# Altium project crw.PrjPCB
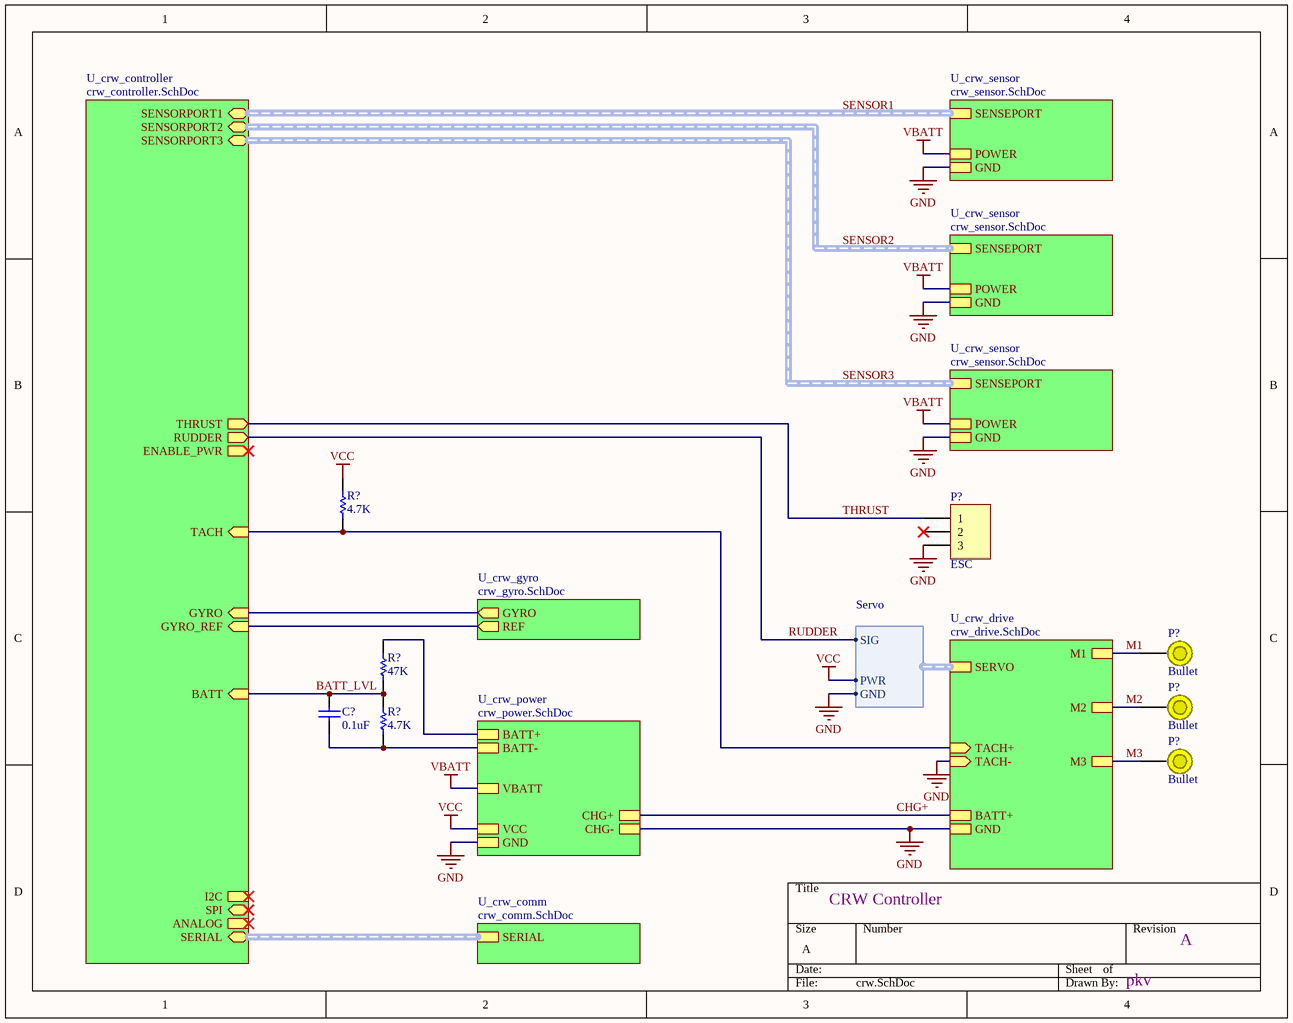
[diagram p0: crw.SchDoc]
7 sheets, 59 parts. Net scope: hierarchical (ports join the sheet entries above them; power ports are global).
Sheets:
  crw.SchDoc
    U_crw_controller = crw_controller.SchDoc
    U_crw_drive = crw_drive.SchDoc
    U_crw_sensor = crw_sensor.SchDoc
    U_crw_sensor = crw_sensor.SchDoc
    U_crw_sensor = crw_sensor.SchDoc
    U_crw_power = crw_power.SchDoc
    U_crw_gyro = crw_gyro.SchDoc
    U_crw_comm = crw_comm.SchDoc

## Sheet crw.SchDoc
size A

### Parts
(Parts that share a designator on the sheet are numbered #1, #2 ... from top to bottom, then left to right.)
C?#1  value 0.1uF  [0805]  (hidden comment: C0805)
P?#1  ESC  [HDR1X3H]
P?#2  Bullet
P?#3  Bullet
P?#4  Bullet
R?#1  value 4.7K  [2012[0805]]  (hidden comment: Res Semi)
R?#2  value 47K  [2012[0805]]  (hidden comment: Res Semi)
R?#3  value 4.7K  [2012[0805]]  (hidden comment: Res Semi)

### Sub-sheets
U_crw_comm = crw_comm.SchDoc: SERIAL (harness Serial)
U_crw_controller = crw_controller.SchDoc: RUDDER (out), THRUST (out), ANALOG (harness Analog), BATT (in), GYRO (in), I2C (harness I2C), ENABLE_PWR (out), SENSORPORT3 (harness SensorPort), SENSORPORT2 (harness SensorPort), SENSORPORT1 (harness SensorPort), SERIAL (harness Serial), TACH (in), GYRO_REF (in), SPI (harness SPI)
U_crw_drive = crw_drive.SchDoc: GND, M1, M2, M3, SERVO (harness Servo), BATT+, TACH+ (in), TACH- (in)
U_crw_gyro = crw_gyro.SchDoc: GYRO (out), REF (out)
U_crw_power = crw_power.SchDoc: BATT+, BATT-, VBATT, GND, CHG+, CHG-, VCC
U_crw_sensor = crw_sensor.SchDoc: SENSEPORT (harness SensorPort), POWER, GND
U_crw_sensor = crw_sensor.SchDoc: SENSEPORT (harness SensorPort), POWER, GND
U_crw_sensor = crw_sensor.SchDoc: SENSEPORT (harness SensorPort), POWER, GND

### Harnesses
Servo: GND, PWR, SIG

### Nets
GND: C?#1.2 P?#1.3 R?#3.2 ; sheet U_crw_drive/GND, sheet U_crw_drive/TACH-, sheet U_crw_sensor/GND, sheet U_crw_sensor/GND, sheet U_crw_sensor/GND, sheet U_crw_power/BATT-, sheet U_crw_power/GND, sheet U_crw_power/CHG-, sheet U_crw_drive/SERVO.GND
VBATT: sheet U_crw_sensor/POWER, sheet U_crw_sensor/POWER, sheet U_crw_sensor/POWER, sheet U_crw_power/VBATT
VCC: R?#1.1 ; sheet U_crw_power/VCC, sheet U_crw_drive/SERVO.PWR
BATT+: R?#2.1 ; sheet U_crw_power/BATT+
BATT_LVL: C?#1.1 R?#2.2 R?#3.1 ; sheet U_crw_controller/BATT
CHG+: sheet U_crw_drive/BATT+, sheet U_crw_power/CHG+
GREF: sheet U_crw_controller/GYRO_REF, sheet U_crw_gyro/REF
GYRO: sheet U_crw_controller/GYRO, sheet U_crw_gyro/GYRO
M1: P?#2.1 ; sheet U_crw_drive/M1
M2: P?#3.1 ; sheet U_crw_drive/M2
M3: P?#4.1 ; sheet U_crw_drive/M3
RUDDER: sheet U_crw_controller/RUDDER, sheet U_crw_drive/SERVO.SIG
THRUST: P?#1.1 ; sheet U_crw_controller/THRUST
NetR?#1_2: R?#1.2 ; sheet U_crw_controller/TACH, sheet U_crw_drive/TACH+

Not connected (* = marked no-connect by the designer): P?#1 2*

### Buses and harness runs
harness SENSOR1 = sheet U_crw_controller/SENSORPORT1 = sheet U_crw_sensor/SENSEPORT
harness SENSOR2 = sheet U_crw_controller/SENSORPORT2 = sheet U_crw_sensor/SENSEPORT
harness SENSOR3 = sheet U_crw_controller/SENSORPORT3 = sheet U_crw_sensor/SENSEPORT
harness sheet U_crw_comm/SERIAL = sheet U_crw_controller/SERIAL

### Notes on the sheet
- CRW Controller
- A
- pkv

### Library data of the parts
C?#1 = C0805: Ceramic Chip Capacitor - Standard; Note: Footprint corresponds to dimensions for bulk cassette packaging. This case size has tightened tolerances.; Published: 17-Jul-2002; LatestRevisionDate: 19-Mar-2004; LatestRevisionNote: Silkscreen size reduced.; DatasheetDocument: Mar-2001; PackageDocument: Mar-2001; PackageReference: 0805; Publisher: Altium Limited; Code_JEITA: 0805; Code_IPC: 2012[0805]; ComponentLink1Description: Manufacturer Link; ComponentLink1URL: http://www.kemet.com/; ComponentLink2Description: Datasheet; ComponentLink2URL: http://www.kemet.com/kemet/web/homepage/kechome.nsf/vapubfilesname/F3102TA.pdf/$file/F3102TA.pdf
P?#1 = Header 3H: Header, 3-Pin, Right Angle; LatestRevisionDate: 17-Jul-2002; LatestRevisionNote: Re-released for DXP Platform.; Publisher: Altium Limited
P?#2-P?#4 = BulletConnector: 3.5mm Plated Bullet Style Connector
R?#1-R?#3 = Res Semi: Semiconductor Resistor; Published: 8-Jun-2000; LatestRevisionDate: 17-Jul-2002; LatestRevisionNote: Re-released for DXP Platform.; PackageReference: AXIAL-0.5; Publisher: Altium Limited

## Sheet crw_controller.SchDoc
size A
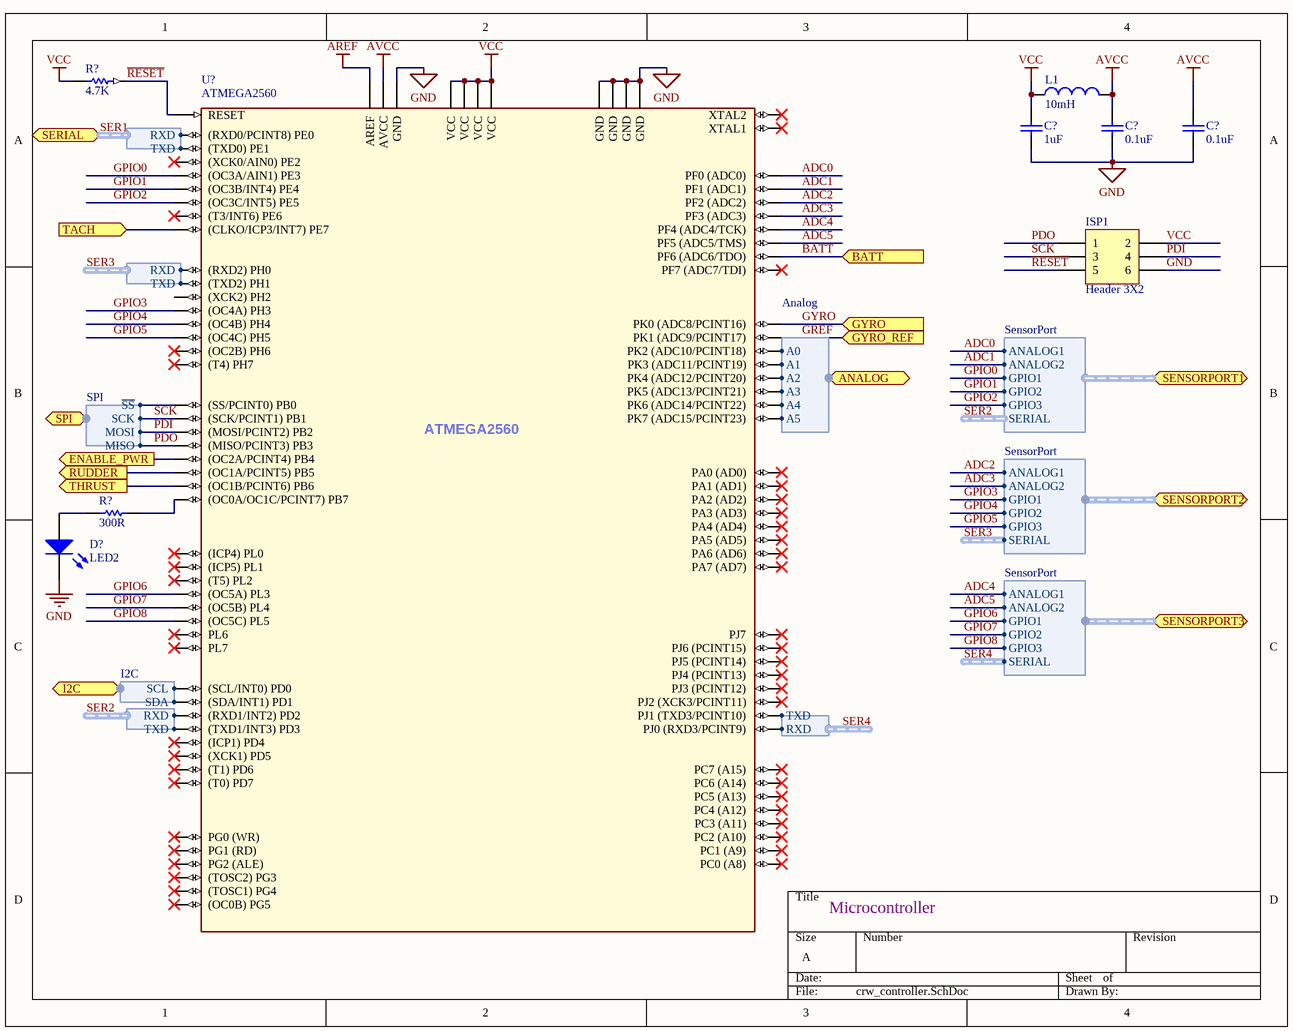
[diagram p1: crw_controller.SchDoc]

### Parts
(Parts that share a designator on the sheet are numbered #1, #2 ... from top to bottom, then left to right.)
C?#2  value 1uF  [0805]  (hidden comment: C0805)
C?#3  value 0.1uF  [0805]  (hidden comment: C0805)
C?#4  value 0.1uF  [0805]  (hidden comment: C0805)
D?#1  LED2  [3.2X1.6X1.1]
ISP1  Header 3X2  [HDR2X3]
L1  value 10mH  [3261]  (hidden comment: Inductor)
R?#4  value 4.7K  [2012[0805]]  (hidden comment: Res Semi)
R?#5  value 300R  [2012[0805]]  (hidden comment: Res Semi)
U?#1  ATMEGA2560  [MY_ATMEGA2560]

### Ports
ANALOG (harness Analog), BATT (in), ENABLE_PWR (out), GYRO (in), GYRO_REF (in), I2C (harness I2C), RUDDER (out), SENSORPORT1 (harness SensorPort), SENSORPORT2 (harness SensorPort), SENSORPORT3 (harness SensorPort), SERIAL (harness Serial), SPI (harness SPI), TACH (in), THRUST (out)

### Harnesses
Serial: RXD, TXD
SensorPort: ANALOG1, ANALOG2, GPIO1, GPIO2, GPIO3, SERIAL
Analog: A0, A1, A2, A3, A4, A5
SPI: ~{SS}, SCK, MISO, MOSI
I2C: SDA, SCL

### Nets
AREF: U?#1.98(AREF)
AVCC: C?#3.2 C?#4.2 L1.2 U?#1.100(AVCC)
GND: C?#2.1 C?#3.1 C?#4.1 D?#1.2(K) ISP1.6 U?#1.11(GND) U?#1.32(GND) U?#1.62(GND) U?#1.81(GND) U?#1.99(GND)
VCC: C?#2.2 ISP1.2 L1.1 R?#4.1 U?#1.10(VCC) U?#1.31(VCC) U?#1.61(VCC) U?#1.80(VCC)
ADC0: U?#1.97(PF0_(ADC0)) ; port SENSORPORT1.ANALOG1  [project net SENSOR1.ANALOG1]
ADC1: U?#1.96(PF1_(ADC1)) ; port SENSORPORT1.ANALOG2  [project net SENSOR1.ANALOG2]
ADC2: U?#1.95(PF2_(ADC2)) ; port SENSORPORT2.ANALOG1  [project net SENSOR2.ANALOG1]
ADC3: U?#1.94(PF3_(ADC3)) ; port SENSORPORT2.ANALOG2  [project net SENSOR2.ANALOG2]
ADC4: U?#1.93(PF4_(ADC4/TCK)) ; port SENSORPORT3.ANALOG1  [project net SENSOR3.ANALOG1]
ADC5: U?#1.92(PF5_(ADC5/TMS)) ; port SENSORPORT3.ANALOG2  [project net SENSOR3.ANALOG2]
BATT: U?#1.91(PF6_(ADC6/TDO)) ; port BATT  [project net BATT_LVL]
GPIO0: U?#1.5((OC3A/AIN1)_PE3) ; port SENSORPORT1.GPIO1  [project net SENSOR1.GPIO1]
GPIO1: U?#1.6((OC3B/INT4)_PE4) ; port SENSORPORT1.GPIO2  [project net SENSOR1.GPIO2]
GPIO2: U?#1.7((OC3C/INT5)_PE5) ; port SENSORPORT1.GPIO3  [project net SENSOR1.GPIO3]
GPIO3: U?#1.15((OC4A)_PH3) ; port SENSORPORT2.GPIO1  [project net SENSOR2.GPIO1]
GPIO4: U?#1.16((OC4B)_PH4) ; port SENSORPORT2.GPIO2  [project net SENSOR2.GPIO2]
GPIO5: U?#1.17((OC4C)_PH5) ; port SENSORPORT2.GPIO3  [project net SENSOR2.GPIO3]
GPIO6: U?#1.38((OC5A)_PL3) ; port SENSORPORT3.GPIO1  [project net SENSOR3.GPIO1]
GPIO7: U?#1.39((OC5B)_PL4) ; port SENSORPORT3.GPIO2  [project net SENSOR3.GPIO2]
GPIO8: U?#1.40((OC5C)_PL5) ; port SENSORPORT3.GPIO3  [project net SENSOR3.GPIO3]
GREF: U?#1.88(PK1_(ADC9/PCINT17)) ; port GYRO_REF
GYRO: U?#1.89(PK0_(ADC8/PCINT16)) ; port GYRO
PDI: ISP1.4 U?#1.21((MOSI/PCINT2)_PB2) ; port SPI.MOSI
PDO: ISP1.1 U?#1.22((MISO/PCINT3)_PB3) ; port SPI.MISO
~{RESET}: ISP1.5 R?#4.2 U?#1.30(RESET)
RUDDER: U?#1.24((OC1A/PCINT5)_PB5) ; port RUDDER
SCK: ISP1.3 U?#1.20((SCK/PCINT1)_PB1) ; port SPI.SCK
SER2.RXD: U?#1.45((RXD1/INT2)_PD2) ; harness Serial.RXD
SER2.TXD: U?#1.46((TXD1/INT3)_PD3) ; harness Serial.TXD
SER4.RXD: U?#1.63(PJ0_(RXD3/PCINT9)) ; harness Serial.RXD
SER4.TXD: U?#1.64(PJ1_(TXD3/PCINT10)) ; harness Serial.TXD
THRUST: U?#1.25((OC1B/PCINT6)_PB6) ; port THRUST
NetD?#1_1: D?#1.1(A) R?#5.1
NetR?#1_2: U?#1.9((CLKO/ICP3/INT7)_PE7) ; port TACH
NetR?#5_2: R?#5.2 U?#1.26((OC0A/OC1C/PCINT7)_PB7)
NetU?#1_19: U?#1.19((SS/PCINT0)_PB0) ; port SPI.~{SS}
NetU?#1_23: U?#1.23((OC2A/PCINT4)_PB4) ; port ENABLE_PWR
NetU?#1_43: U?#1.43((SCL/INT0)_PD0) ; port I2C.SCL
NetU?#1_44: U?#1.44((SDA/INT1)_PD1) ; port I2C.SDA
NetU?#1_82: U?#1.82(PK7_(ADC15/PCINT23)) ; port ANALOG.A5
NetU?#1_83: U?#1.83(PK6_(ADC14/PCINT22)) ; port ANALOG.A4
NetU?#1_84: U?#1.84(PK5_(ADC13/PCINT21)) ; port ANALOG.A3
NetU?#1_85: U?#1.85(PK4_(ADC12/PCINT20)) ; port ANALOG.A2
NetU?#1_86: U?#1.86(PK3_(ADC11/PCINT19)) ; port ANALOG.A1
NetU?#1_87: U?#1.87(PK2_(ADC10/PCINT18)) ; port ANALOG.A0

Not connected (* = marked no-connect by the designer): U?#1 1((OC0B)_PG5)* 2((RXD0/PCINT8)_PE0) 3((TXD0)_PE1) 4((XCK0/AIN0)_PE2)* 8((T3/INT6)_PE6)* 12((RXD2)_PH0) 13((TXD2)_PH1) 14((XCK2)_PH2) 18((OC2B)_PH6)* 27((T4)_PH7)* 28((TOSC2)_PG3)* 29((TOSC1)_PG4)* 33(XTAL2)* 34(XTAL1)* 35((ICP4)_PL0)* 36((ICP5)_PL1)* 37((T5)_PL2)* 41(PL6)* 42(PL7)* 47((ICP1)_PD4)* 48((XCK1)_PD5)* 49((T1)_PD6)* 50((T0)_PD7)* 51(PG0_(WR))* 52(PG1_(RD))* 53(PC0_(A8))* 54(PC1_(A9))* 55(PC2_(A10))* 56(PC3_(A11))* 57(PC4_(A12))* 58(PC5_(A13))* 59(PC6_(A14))* 60(PC7_(A15))* 65(PJ2_(XCK3/PCINT11))* 66(PJ3_(PCINT12))* 67(PJ4_(PCINT13))* 68(PJ5_(PCINT14))* 69(PJ6_(PCINT15))* 70(PG2_(ALE))* 71(PA7_(AD7))* 72(PA6_(AD6))* 73(PA5_(AD5))* 74(PA4_(AD4))* 75(PA3_(AD3))* 76(PA2_(AD2))* 77(PA1_(AD1))* 78(PA0_(AD0))* 79(PJ7)* 90(PF7_(ADC7/TDI))*

### Buses and harness runs
harness SER1 = port SERIAL

### Notes on the sheet
- Microcontroller

### Library data of the parts
C?#2-C?#4 = C0805: as C?#1 on sheet crw; Published: 17-Jul-2002; LatestRevisionDate: 19-Mar-2004; LatestRevisionNote: Silkscreen size reduced.; DatasheetDocument: Mar-2001; PackageDocument: Mar-2001; PackageReference: 0805; Publisher: Altium Limited; Code_JEITA: 0805; Code_IPC: 2012[0805]; ComponentLink1Description: Manufacturer Link; ComponentLink1URL: http://www.kemet.com/; ComponentLink2Description: Datasheet; ComponentLink2URL: http://www.kemet.com/kemet/web/homepage/kechome.nsf/vapubfilesname/F3102TA.pdf/$file/F3102TA.pdf
D?#1 = LED2: Typical RED, GREEN, YELLOW, AMBER GaAs LED; Published: 8-Jun-2000; LatestRevisionDate: 17-Jul-2002; LatestRevisionNote: Re-released for DXP Platform.; PackageDocument: Feb-2002; PackageReference: 3.2X1.6X1.1; Publisher: Altium Limited
ISP1 = Header 3X2: Header, 3-Pin, Dual row; LatestRevisionDate: 17-Jul-2002; LatestRevisionNote: Re-released for DXP Platform.; Publisher: Altium Limited
L1 = Inductor: Code_IEC: 1005; Published: 8-Jun-2000; LatestRevisionDate: 17-Jul-2002; LatestRevisionNote: Re-released for DXP Platform.; PackageReference: 0402-A; Publisher: Altium Limited; Code_JEITA: 0402
R?#4 R?#5 = Res Semi: Semiconductor Resistor; Published: 8-Jun-2000; LatestRevisionDate: 17-Jul-2002; LatestRevisionNote: Re-released for DXP Platform.; PackageReference: AXIAL-0.5; Publisher: Altium Limited
U?#1 = ATMEGA2560: AVR 256K Bytes of In-System Programmable Flash Memory

## Sheet crw_drive.SchDoc
size A
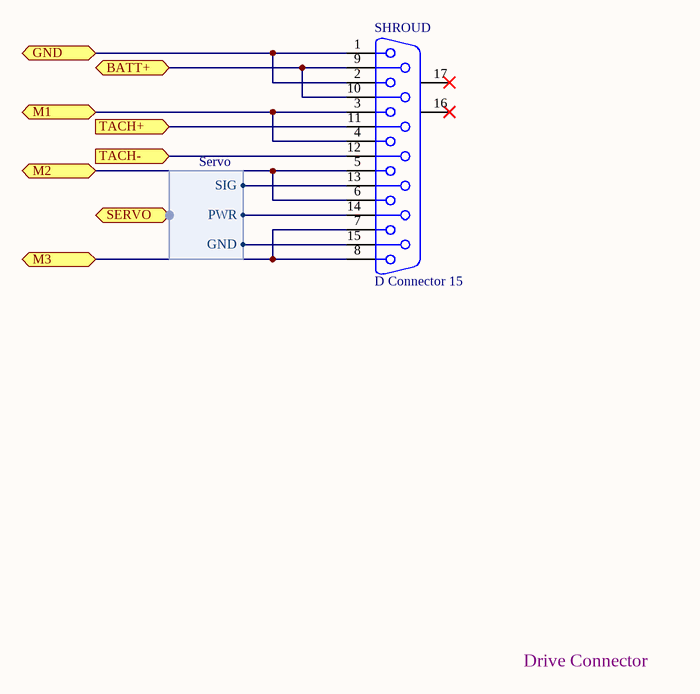
[diagram p2: crw_drive.SchDoc]

### Parts
SHROUD  D Connector 15  [DSUB1.385-2H15]

### Ports
BATT+, GND, M1, M2, M3, SERVO (harness Servo), TACH+ (in), TACH- (in)

### Harnesses
Servo: SIG, PWR, GND

### Nets
GND: SHROUD.1 SHROUD.2 SHROUD.12 SHROUD.15 ; port GND, port TACH-, port SERVO.GND
VCC: SHROUD.14 ; port SERVO.PWR
CHG+: SHROUD.9 SHROUD.10 ; port BATT+
M1: SHROUD.3 SHROUD.4 ; port M1
M2: SHROUD.5 SHROUD.6 ; port M2
M3: SHROUD.7 SHROUD.8 ; port M3
RUDDER: SHROUD.13 ; port SERVO.SIG
NetR?#1_2: SHROUD.11 ; port TACH+

Not connected (* = marked no-connect by the designer): SHROUD 16(MH1)* 17(MH2)*

### Notes on the sheet
- Drive Connector

### Library data of the parts
SHROUD = D Connector 15: Receptacle Assembly, 15 Position, Right Angle; PackageDocument: O; Positions: 15; Published: 15-Jun-2001; LatestRevisionDate: 17-Jul-2002; LatestRevisionNote: Re-released for DXP Platform.; DatasheetDocument: 1-Sep-99; PackageReference: 788757; Publisher: Altium Limited; Orientation: Right Angle; Gender: Receptacle

## Sheet crw_sensor.SchDoc
size A
Used 3 times, as channels U_crw_sensor, U_crw_sensor, U_crw_sensor. Parts and nets are listed once, with the designators drawn on the sheet.
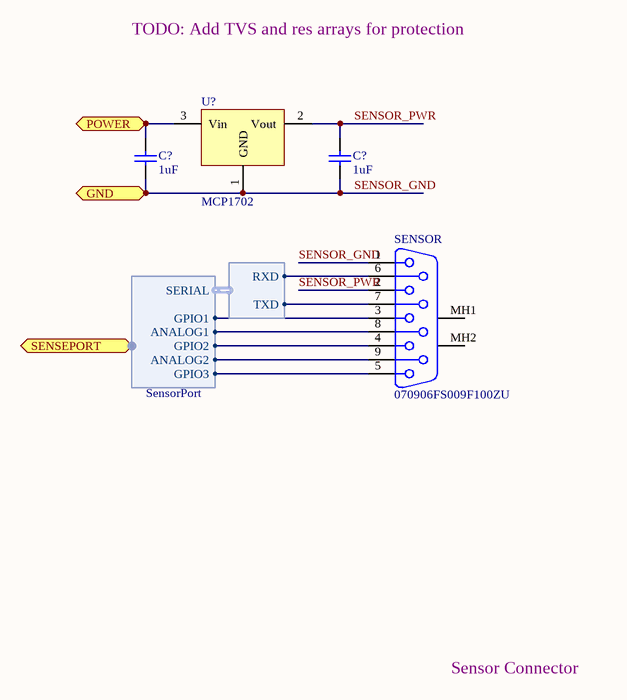
[diagram p3: crw_sensor.SchDoc]

### Parts
(Parts that share a designator on the sheet are numbered #1, #2 ... from top to bottom, then left to right.)
C?#1  value 1uF  [0805]  (hidden comment: C0805)
C?#2  value 1uF  [0805]  (hidden comment: C0805)
SENSOR  070906FS009F100ZU  [070906FS009]
U?  MCP1702  [SO-G3]

### Ports
GND, POWER, SENSEPORT (harness SensorPort)

### Harnesses
SensorPort: ANALOG1, ANALOG2, GPIO1, GPIO2, GPIO3, SERIAL
Serial: RXD, TXD

### Nets
POWER: C?#1.2 U?.3(Vin) ; port POWER
SENSOR_GND: C?#1.1 C?#2.1 SENSOR.1 U?.1(GND) ; port GND
SENSOR_PWR: C?#2.2 SENSOR.2 U?.2(Vout)
NetSENSOR_3: SENSOR.3 ; port SENSEPORT.GPIO1
NetSENSOR_4: SENSOR.4 ; port SENSEPORT.GPIO2
NetSENSOR_5: SENSOR.5 ; port SENSEPORT.GPIO3
NetSENSOR_6: SENSOR.6 ; harness Serial.RXD
NetSENSOR_7: SENSOR.7 ; harness Serial.TXD
NetSENSOR_8: SENSOR.8 ; port SENSEPORT.ANALOG1
NetSENSOR_9: SENSOR.9 ; port SENSEPORT.ANALOG2

Not connected (* = marked no-connect by the designer): SENSOR MH1 MH2

### Channels
U_crw_sensor: designators C?=C?_U_crw_sensor#2 C?=C?_U_crw_sensor#1 SENSOR=SENSOR_U_crw_sensor#1 U?=U?_U_crw_sensor#1; ports GND=GND POWER=VBATT
U_crw_sensor: designators C?=C?_U_crw_sensor#4 C?=C?_U_crw_sensor#3 SENSOR=SENSOR_U_crw_sensor#2 U?=U?_U_crw_sensor#2; ports GND=GND POWER=VBATT
U_crw_sensor: designators C?=C?_U_crw_sensor#6 C?=C?_U_crw_sensor#5 SENSOR=SENSOR_U_crw_sensor#3 U?=U?_U_crw_sensor#3; ports GND=GND POWER=VBATT

### Notes on the sheet
- TODO: Add TVS and res arrays for protection
- Sensor Connector

### Library data of the parts
C?#1 C?#2 = C0805: as C?#1 on sheet crw; Published: 17-Jul-2002; LatestRevisionDate: 19-Mar-2004; LatestRevisionNote: Silkscreen size reduced.; DatasheetDocument: Mar-2001; PackageDocument: Mar-2001; PackageReference: 0805; Publisher: Altium Limited; Code_JEITA: 0805; Code_IPC: 2012[0805]; ComponentLink1Description: Manufacturer Link; ComponentLink1URL: http://www.kemet.com/; ComponentLink2Description: Datasheet; ComponentLink2URL: http://www.kemet.com/kemet/web/homepage/kechome.nsf/vapubfilesname/F3102TA.pdf/$file/F3102TA.pdf
SENSOR = 070906FS009F100ZU: Ultra Thin D-Sub, Straight Dip Type, Female Connector, THT, 9 Position, 2.2mm Pin Length; PCB_Layout: Complies with manufacturer's recommendation.; DrillSize: Corresponds to nominal value.; Published: 26-Sep-2008; DatasheetVersion: May-2003; PackageVersion: revK, Nov-2007; PackageReference: 070906FS009; Publisher: Altium Limited; PackageDescription: Connector; D-Sub, Thru-Hole; 9 Position; Vertical; Body 30.81 x 9.60 x 8.20 mm (LxWxH); ComponentLink1Description: Manufacturer Link; ComponentLink1URL: http://www.suyin.com/; ComponentLink2Description: Datasheet; ComponentLink2URL: http://www.suyin.at/pdf/i_o/d_sub/female/straight/070906FS.pdf
U? = MCP1702: 2 uA Low Dropout Positive Voltage Regulator

## Sheet crw_power.SchDoc
size A
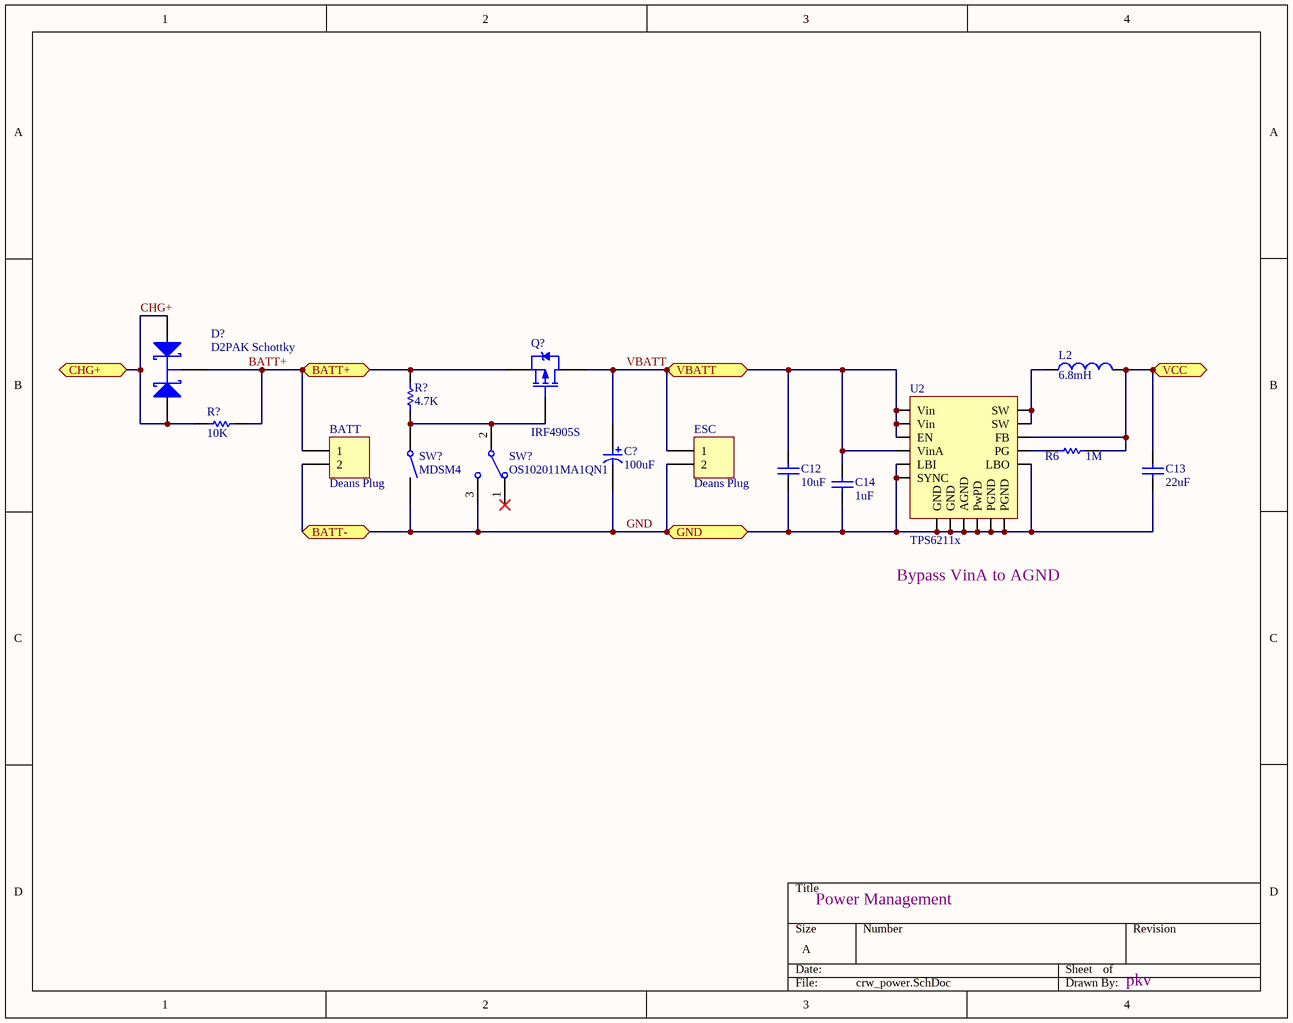
[diagram p4: crw_power.SchDoc]

### Parts
(Parts that share a designator on the sheet are numbered #1, #2 ... from top to bottom, then left to right.)
BATT  Deans Plug
C12  value 10uF  [C1206]  (hidden comment: Cap Semi)
C13  value 22uF  [C1206]  (hidden comment: Cap Semi)
C14  value 1uF  [C1206]  (hidden comment: Cap Semi)
C?#5  value 100uF  [WX Series Capacitor (6.3mm Body)]  (hidden comment: Cap Pol)
D?#2  D2PAK Schottky  [D2PAK]
ESC  Deans Plug
L2  value 6.8mH  [3261]  (hidden comment: Inductor)
Q?  IRF4905S  [D2PAK]
R6  value 1M  [3216[1206]]  (hidden comment: Res Semi)
R?#6  value 4.7K  [2012[0805]]  (hidden comment: Res Semi)
R?#7  value 10K  [2012[0805]]  (hidden comment: Res Semi)
SW?#1  MDSM4  [MDSM4]
SW?#2  OS102011MA1QN1  [OS102011MA1QN1]
U2  TPS6211x  [QFN65P400X400X80-16N]

### Ports
BATT+, BATT-, CHG+, GND, VBATT, VCC

### Nets
GND: BATT.2 C12.1 C13.1 C14.1 C?#5.2 ESC.2 SW?#1.2 SW?#2.3 U2.1(PGND) U2.5(SYNC) U2.6(LBO) U2.7(LBI) U2.9(AGND) U2.11(GND) U2.12(GND) U2.16(PGND) U2.PAD(PwPD) ; port BATT-, port GND
VBATT: C12.2 C14.2 C?#5.1 ESC.1 Q?.2(D) U2.2(Vin) U2.3(Vin) U2.4(EN) U2.8(VinA) ; port VBATT
VCC: C13.2 L2.2 R6.2 U2.10(FB) ; port VCC
BATT+: BATT.1 D?#2.2(K) Q?.3(S) R?#6.1 R?#7.1 ; port BATT+
CHG+: D?#2.1(A1) D?#2.3(A2) R?#7.2 ; port CHG+
NetL2_1: L2.1 U2.14(SW) U2.15(SW)
NetQ?_1: Q?.1(G) R?#6.2 SW?#1.1 SW?#2.2
NetR6_1: R6.1 U2.13(PG)

Not connected (* = marked no-connect by the designer): SW?#2 1*

### Notes on the sheet
- (near U2) Bypass VinA to AGND
- Power Management
- pkv

### Library data of the parts
BATT ESC = DeansUltraPlug2P: Deans 2-pin Ultra Plug
C12-C14 = Cap Semi: Capacitor (Semiconductor SIM Model); Published: 8-Jun-2000; LatestRevisionDate: 17-Jul-2002; LatestRevisionNote: Re-released for DXP Platform.; PackageReference: C1206; Publisher: Altium Limited
C?#5 = Cap Pol: Polarized Capacitor
D?#2 = 10CTQ150S: Schottky Rectifier; Note: Terminal 2 is the TAB and is electrically connected to the cathode; Published: 8-Jun-2000; LatestRevisionDate: 17-Jul-2002; LatestRevisionNote: Re-released for DXP Platform.; DatasheetDocument: Apr-1999; PackageReference: D2PAK; Publisher: Altium Limited; ComponentLink1Description: Manufacturer Link; ComponentLink1URL: http://www.irf.com/; ComponentLink2Description: Datasheet; ComponentLink2URL: http://www.irf.com/product-info/datasheets/data/10ctq150.pdf
L2 = Inductor: Code_IEC: 1005; Published: 8-Jun-2000; LatestRevisionDate: 17-Jul-2002; LatestRevisionNote: Re-released for DXP Platform.; PackageReference: 0402-A; Publisher: Altium Limited; Code_JEITA: 0402
Q? = IRF4905S: HEXFET Power MOSFET; Published: 8-Jun-2000; LatestRevisionDate: 17-Jul-2002; LatestRevisionNote: Re-released for DXP Platform.; DatasheetVersion: Aug-1997; PackageReference: D2PAK; Publisher: Altium Limited; PackageDescription: D2-PAK/TO-263-AB; 3 Leads (1 Cropped); Body 15.5 (inc. leads) x 10.5 mm (LxW max); ComponentLink1Description: Manufacturer Link; ComponentLink1URL: http://www.irf.com/; ComponentLink2Description: Datasheet; ComponentLink2URL: http://www.irf.com/product-info/datasheets/data/irf4905s.pdf
R6 R?#6 R?#7 = Res Semi: Semiconductor Resistor; Published: 8-Jun-2000; LatestRevisionDate: 17-Jul-2002; LatestRevisionNote: Re-released for DXP Platform.; PackageReference: AXIAL-0.5; Publisher: Altium Limited
SW?#1 = MDSM4: SMT Reed Switch
SW?#2 = OS102011MA1QN1: Miniature SPDT Slide Switch

## Sheet crw_gyro.SchDoc
size A
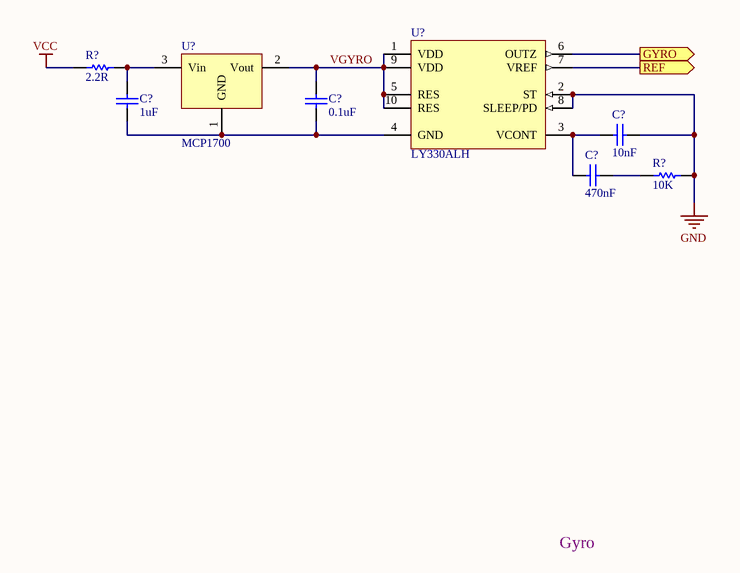
[diagram p5: crw_gyro.SchDoc]

### Parts
(Parts that share a designator on the sheet are numbered #1, #2 ... from top to bottom, then left to right.)
C?#6  value 1uF  [0805]  (hidden comment: C0805)
C?#7  value 0.1uF  [0805]  (hidden comment: C0805)
C?#8  value 10nF  [0805]  (hidden comment: C0805)
C?#9  value 470nF  [0805]  (hidden comment: C0805)
R?#8  value 2.2R  [2012[0805]]  (hidden comment: Res Semi)
R?#9  value 10K  [2012[0805]]  (hidden comment: Res Semi)
U?#2  LY330ALH
U?#3  MCP1700  [SO-G3]

### Ports
GYRO (out), REF (out)

### Nets
GND: C?#8.2 R?#9.1 U?#2.2(ST) U?#2.8(SLEEP/PD)
VCC: R?#8.1
GREF: U?#2.7(VREF) ; port REF
GYRO: U?#2.6(OUTZ) ; port GYRO
VGYRO: C?#7.1 U?#2.1(VDD) U?#2.5(RES) U?#2.9(VDD) U?#2.10(RES) U?#3.2(Vout)
NetC?#6_1: C?#6.1 R?#8.2 U?#3.3(Vin)
NetC?#6_2: C?#6.2 C?#7.2 U?#2.4(GND) U?#3.1(GND)
NetC?#8_1: C?#8.1 C?#9.2 U?#2.3(VCONT)
NetC?#9_1: C?#9.1 R?#9.2

### Notes on the sheet
- Gyro

### Library data of the parts
C?#6-C?#9 = C0805: as C?#1 on sheet crw; Published: 17-Jul-2002; LatestRevisionDate: 19-Mar-2004; LatestRevisionNote: Silkscreen size reduced.; DatasheetDocument: Mar-2001; PackageDocument: Mar-2001; PackageReference: 0805; Publisher: Altium Limited; Code_JEITA: 0805; Code_IPC: 2012[0805]; ComponentLink1Description: Manufacturer Link; ComponentLink1URL: http://www.kemet.com/; ComponentLink2Description: Datasheet; ComponentLink2URL: http://www.kemet.com/kemet/web/homepage/kechome.nsf/vapubfilesname/F3102TA.pdf/$file/F3102TA.pdf
R?#8 R?#9 = Res Semi: Semiconductor Resistor; Published: 8-Jun-2000; LatestRevisionDate: 17-Jul-2002; LatestRevisionNote: Re-released for DXP Platform.; PackageReference: AXIAL-0.5; Publisher: Altium Limited
U?#2 = LY330ALH: MEMS motion sensor: high performance ±300 dps analog yaw-rate gyroscope
U?#3 = MCP1702: as U? on sheet crw_sensor

## Sheet crw_comm.SchDoc
size A
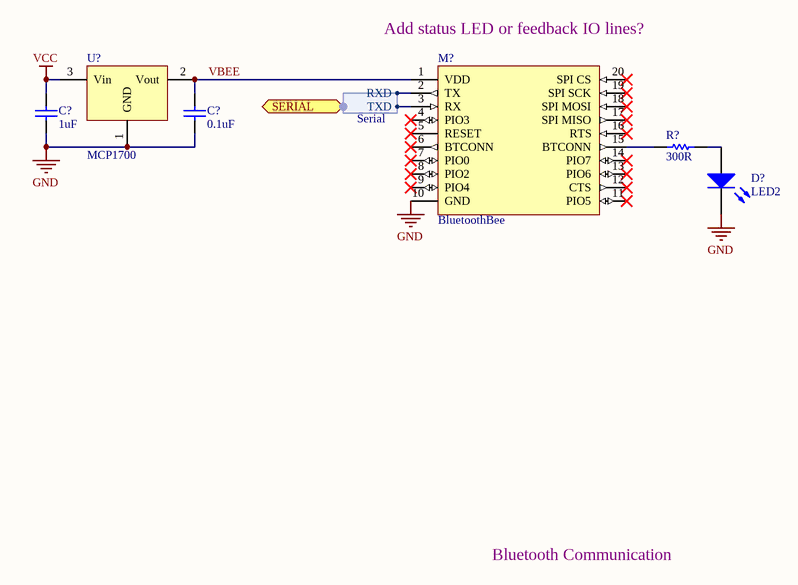
[diagram p6: crw_comm.SchDoc]

### Parts
(Parts that share a designator on the sheet are numbered #1, #2 ... from top to bottom, then left to right.)
C?#10  value 1uF  [0805]  (hidden comment: C0805)
C?#11  value 0.1uF  [0805]  (hidden comment: C0805)
D?#3  LED2  [3.2X1.6X1.1]
M?  BluetoothBee  [XBee]
R?#10  value 300R  [2012[0805]]  (hidden comment: Res Semi)
U?#4  MCP1700  [SO-G3]

### Ports
SERIAL (harness Serial)

### Harnesses
Serial: RXD, TXD

### Nets
GND: C?#10.2 C?#11.2 D?#3.2(K) M?.10(GND) U?#4.1(GND)
VCC: C?#10.1 U?#4.3(Vin)
SER1.RXD: M?.2(TX) ; port SERIAL.RXD
SER1.TXD: M?.3(RX) ; port SERIAL.TXD
VBEE: C?#11.1 M?.1(VDD) U?#4.2(Vout)
NetD?#3_1: D?#3.1(A) R?#10.2
NetM?_15: M?.15(BTCONN) R?#10.1

Not connected (* = marked no-connect by the designer): M? 4(PIO3)* 5(RESET)* 6(BTCONN)* 7(PIO0)* 8(PIO2)* 9(PIO4)* 11(PIO5)* 12(CTS)* 13(PIO6)* 14(PIO7)* 16(RTS)* 17(SPI_MISO)* 18(SPI_MOSI)* 19(SPI_SCK)* 20(SPI_CS)*

### Notes on the sheet
- (near M?) Add status LED or feedback IO lines?
- Bluetooth Communication

### Library data of the parts
C?#10 C?#11 = C0805: as C?#1 on sheet crw; Published: 17-Jul-2002; LatestRevisionDate: 19-Mar-2004; LatestRevisionNote: Silkscreen size reduced.; DatasheetDocument: Mar-2001; PackageDocument: Mar-2001; PackageReference: 0805; Publisher: Altium Limited; Code_JEITA: 0805; Code_IPC: 2012[0805]; ComponentLink1Description: Manufacturer Link; ComponentLink1URL: http://www.kemet.com/; ComponentLink2Description: Datasheet; ComponentLink2URL: http://www.kemet.com/kemet/web/homepage/kechome.nsf/vapubfilesname/F3102TA.pdf/$file/F3102TA.pdf
D?#3 = LED2: as D?#1 on sheet crw_controller; Published: 8-Jun-2000; LatestRevisionDate: 17-Jul-2002; LatestRevisionNote: Re-released for DXP Platform.; PackageDocument: Feb-2002; PackageReference: 3.2X1.6X1.1; Publisher: Altium Limited
M? = DFBluetoothBee: DFRobot Bluetooth Bee Wireless Module
R?#10 = Res Semi: Semiconductor Resistor; Published: 8-Jun-2000; LatestRevisionDate: 17-Jul-2002; LatestRevisionNote: Re-released for DXP Platform.; PackageReference: AXIAL-0.5; Publisher: Altium Limited
U?#4 = MCP1702: as U? on sheet crw_sensor

## Nets that join several sheets
GND: crw (C?#1.2 P?#1.3 R?#3.2), crw_controller (10 pins), crw_drive (SHROUD.1 SHROUD.2 SHROUD.12 SHROUD.15), U_crw_sensor (C?_U_crw_sensor#1.1 C?_U_crw_sensor#2.1 SENSOR_U_crw_sensor#1.1 U?_U_crw_sensor#1.1), U_crw_sensor (C?_U_crw_sensor#3.1 C?_U_crw_sensor#4.1 SENSOR_U_crw_sensor#2.1 U?_U_crw_sensor#2.1), U_crw_sensor (C?_U_crw_sensor#5.1 C?_U_crw_sensor#6.1 SENSOR_U_crw_sensor#3.1 U?_U_crw_sensor#3.1), crw_power (17 pins), crw_gyro (C?#8.2 R?#9.1 U?#2.2 U?#2.8), crw_comm (5 pins)
VBATT: U_crw_sensor (C?_U_crw_sensor#1.2 U?_U_crw_sensor#1.3), U_crw_sensor (C?_U_crw_sensor#3.2 U?_U_crw_sensor#2.3), U_crw_sensor (C?_U_crw_sensor#5.2 U?_U_crw_sensor#3.3), crw_power (9 pins)
VCC: crw (R?#1.1), crw_controller (8 pins), crw_drive (SHROUD.14), crw_power (C13.2 L2.2 R6.2 U2.10), crw_gyro (R?#8.1), crw_comm (C?#10.1 U?#4.3)
BATT+: crw (R?#2.1), crw_power (5 pins)
BATT_LVL: crw (C?#1.1 R?#2.2 R?#3.1), crw_controller (U?#1.91)
CHG+: crw_drive (SHROUD.9 SHROUD.10), crw_power (D?#2.1 D?#2.3 R?#7.2)
GREF: crw_controller (U?#1.88), crw_gyro (U?#2.7)
GYRO: crw_controller (U?#1.89), crw_gyro (U?#2.6)
M1: crw (P?#2.1), crw_drive (SHROUD.3 SHROUD.4)
M2: crw (P?#3.1), crw_drive (SHROUD.5 SHROUD.6)
M3: crw (P?#4.1), crw_drive (SHROUD.7 SHROUD.8)
NetR?#1_2: crw (R?#1.2), crw_controller (U?#1.9), crw_drive (SHROUD.11)
RUDDER: crw_controller (U?#1.24), crw_drive (SHROUD.13)
SENSOR1.ANALOG1: crw_controller (U?#1.97), U_crw_sensor (SENSOR_U_crw_sensor#1.8)
SENSOR1.ANALOG2: crw_controller (U?#1.96), U_crw_sensor (SENSOR_U_crw_sensor#1.9)
SENSOR1.GPIO1: crw_controller (U?#1.5), U_crw_sensor (SENSOR_U_crw_sensor#1.3)
SENSOR1.GPIO2: crw_controller (U?#1.6), U_crw_sensor (SENSOR_U_crw_sensor#1.4)
SENSOR1.GPIO3: crw_controller (U?#1.7), U_crw_sensor (SENSOR_U_crw_sensor#1.5)
SENSOR2.ANALOG1: crw_controller (U?#1.95), U_crw_sensor (SENSOR_U_crw_sensor#2.8)
SENSOR2.ANALOG2: crw_controller (U?#1.94), U_crw_sensor (SENSOR_U_crw_sensor#2.9)
SENSOR2.GPIO1: crw_controller (U?#1.15), U_crw_sensor (SENSOR_U_crw_sensor#2.3)
SENSOR2.GPIO2: crw_controller (U?#1.16), U_crw_sensor (SENSOR_U_crw_sensor#2.4)
SENSOR2.GPIO3: crw_controller (U?#1.17), U_crw_sensor (SENSOR_U_crw_sensor#2.5)
SENSOR3.ANALOG1: crw_controller (U?#1.93), U_crw_sensor (SENSOR_U_crw_sensor#3.8)
SENSOR3.ANALOG2: crw_controller (U?#1.92), U_crw_sensor (SENSOR_U_crw_sensor#3.9)
SENSOR3.GPIO1: crw_controller (U?#1.38), U_crw_sensor (SENSOR_U_crw_sensor#3.3)
SENSOR3.GPIO2: crw_controller (U?#1.39), U_crw_sensor (SENSOR_U_crw_sensor#3.4)
SENSOR3.GPIO3: crw_controller (U?#1.40), U_crw_sensor (SENSOR_U_crw_sensor#3.5)
SER2.RXD: crw_controller (U?#1.45), U_crw_sensor (SENSOR_U_crw_sensor#1.6)
SER2.TXD: crw_controller (U?#1.46), U_crw_sensor (SENSOR_U_crw_sensor#1.7)
SER4.RXD: crw_controller (U?#1.63), U_crw_sensor (SENSOR_U_crw_sensor#3.6)
SER4.TXD: crw_controller (U?#1.64), U_crw_sensor (SENSOR_U_crw_sensor#3.7)
THRUST: crw (P?#1.1), crw_controller (U?#1.25)